# Altium schematic sheet Extruder.SchDoc: Extruder
size A4; DrawnBy: oaba200
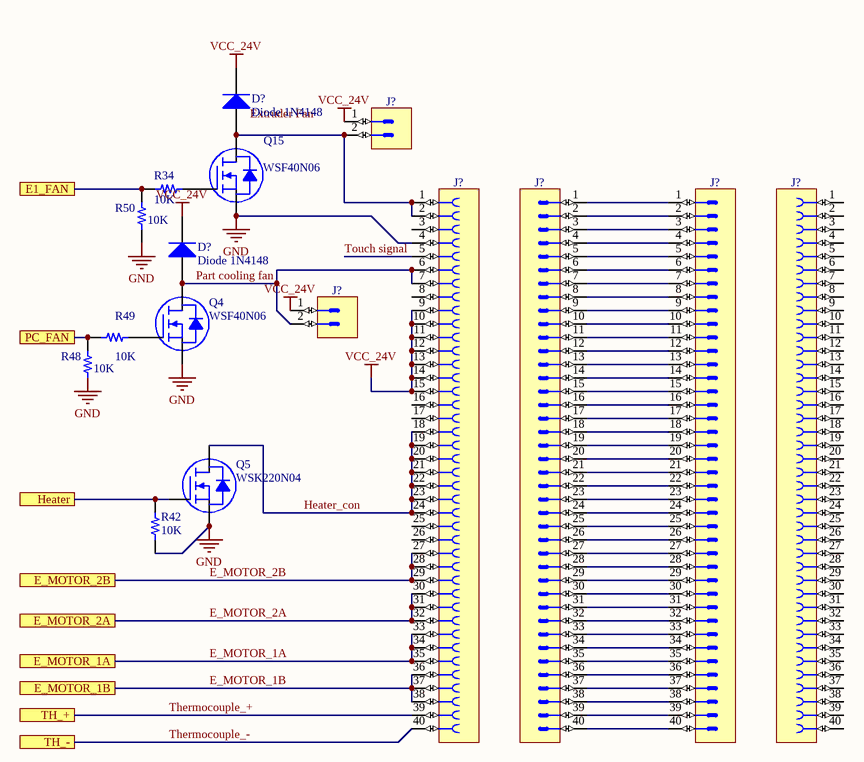
[diagram p0: Extruder.SchDoc]

## Parts
(Parts that share a designator on the sheet are numbered #1, #2 ... from top to bottom, then left to right.)
D?#1  Diode 1N4148  [DO-35]
D?#2  Diode 1N4148  [DO-35]
J?#1  (no value)
J?#2  (no value)
J?#3  (no value)
J?#4  (no value)
J?#5  (no value)
J?#6  (no value)
Q4  WSF40N06  [TO263]
Q5  WSK220N04  [TO263]
Q15  WSF40N06  [TO263]
R34  10K  [RES 0805_2012]
R42  10K  [RES 0805_2012]
R48  10K  [RES 0805_2012]
R49  10K  [RES 0805_2012]
R50  10K  [RES 0805_2012]

## Ports
E1_FAN, E_MOTOR_1A, E_MOTOR_1B, E_MOTOR_2A, E_MOTOR_2B, Heater, PC_FAN, TH_+, TH_-

## Nets
GND: J?#2.4 Q4.2(S) Q5.2(S) Q15.2(S) R42.1 R50.1
VCC_24V: D?#1.2(K) D?#2.2(K) J?#1.1 J?#2.9 J?#2.10 J?#2.11 J?#2.12 J?#2.13 J?#2.14 J?#2.15 J?#6.1
E1_FAN: R34.1 R50.2 ; port E1_FAN
E_MOTOR_1A: J?#2.33 J?#2.34 J?#2.35 ; port E_MOTOR_1A
E_MOTOR_1B: J?#2.36 J?#2.37 J?#2.38 ; port E_MOTOR_1B
E_MOTOR_2A: J?#2.30 J?#2.31 J?#2.32 ; port E_MOTOR_2A
E_MOTOR_2B: J?#2.27 J?#2.28 J?#2.29 ; port E_MOTOR_2B
Heater: Q5.1(G) R42.2 ; port Heater
Heater_con: J?#2.18 J?#2.19 J?#2.20 J?#2.21 J?#2.22 J?#2.23 J?#2.24 Q5.3(D)
Part cooling fan: D?#2.1(A) J?#2.6 J?#2.7 J?#6.2 Q4.3(D)
PC_FAN: R48.2 R49.1 ; port PC_FAN
Thermocouple_+: J?#2.39 ; port TH_+
Thermocouple_-: J?#2.40 ; port TH_-
Touch signal: J?#2.5
NetD?#1_1: D?#1.1(A) J?#1.2 J?#2.1 J?#2.2 Q15.3(D)
NetJ?#3_1: J?#3.1 J?#4.1
NetJ?#3_2: J?#3.2 J?#4.2
NetJ?#3_3: J?#3.3 J?#4.3
NetJ?#3_4: J?#3.4 J?#4.4
NetJ?#3_5: J?#3.5 J?#4.5
NetJ?#3_6: J?#3.6 J?#4.6
NetJ?#3_7: J?#3.7 J?#4.7
NetJ?#3_8: J?#3.8 J?#4.8
NetJ?#3_9: J?#3.9 J?#4.9
NetJ?#3_10: J?#3.10 J?#4.10
NetJ?#3_11: J?#3.11 J?#4.11
NetJ?#3_12: J?#3.12 J?#4.12
NetJ?#3_13: J?#3.13 J?#4.13
NetJ?#3_14: J?#3.14 J?#4.14
NetJ?#3_15: J?#3.15 J?#4.15
NetJ?#3_16: J?#3.16 J?#4.16
NetJ?#3_17: J?#3.17 J?#4.17
NetJ?#3_18: J?#3.18 J?#4.18
NetJ?#3_19: J?#3.19 J?#4.19
NetJ?#3_20: J?#3.20 J?#4.20
NetJ?#3_21: J?#3.21 J?#4.21
NetJ?#3_22: J?#3.22 J?#4.22
NetJ?#3_23: J?#3.23 J?#4.23
NetJ?#3_24: J?#3.24 J?#4.24
NetJ?#3_25: J?#3.25 J?#4.25
NetJ?#3_26: J?#3.26 J?#4.26
NetJ?#3_27: J?#3.27 J?#4.27
NetJ?#3_28: J?#3.28 J?#4.28
NetJ?#3_29: J?#3.29 J?#4.29
NetJ?#3_30: J?#3.30 J?#4.30
NetJ?#3_31: J?#3.31 J?#4.31
NetJ?#3_32: J?#3.32 J?#4.32
NetJ?#3_33: J?#3.33 J?#4.33
NetJ?#3_34: J?#3.34 J?#4.34
NetJ?#3_35: J?#3.35 J?#4.35
NetJ?#3_36: J?#3.36 J?#4.36
NetJ?#3_37: J?#3.37 J?#4.37
NetJ?#3_38: J?#3.38 J?#4.38
NetJ?#3_39: J?#3.39 J?#4.39
NetJ?#3_40: J?#3.40 J?#4.40
NetQ4_1: Q4.1(G) R49.2
NetQ15_1: Q15.1(G) R34.2

Not connected (* = marked no-connect by the designer): J?#2 3 8 16 17 25 26; J?#5 1 2 3 4 5 6 7 8 9 10 11 12 13 14 15 16 17 18 19 20 21 22 23 24 25 26 27 28 29 30 31 32 33 34 35 36 37 38 39 40; R48 1

## Notes on the sheet
- Labels drawn without touching a wire or pin: Extruder Fan, GND

## Library data of the parts
D?#1 D?#2 = Diode 1N4148: High Conductance Fast Diode; Published: 8-Jun-2000; LatestRevisionDate: 17-Jul-2002; LatestRevisionNote: Re-released for DXP Platform.; DatasheetVersion: 1997; PackageReference: DO-35; Publisher: Altium Limited; PackageDescription: Diode, Axial; Body 3.8 x 1.9 mm (LxDia. max), Lead Dia. 0.53 mm (max); Code_JEDEC: DO-204-AH; ComponentLink1Description: Manufacturer Link; ComponentLink1URL: http://www.fairchildsemi.com/; ComponentLink2Description: Datasheet; ComponentLink2URL: http://www.fairchildsemi.com/ds/1N%2F1N4148.pdf
J?#1 J?#6 = Connector 2 Male
J?#2 J?#5 = Connector 40 Female
J?#3 J?#4 = Connector 40 Male
Q4 Q5 Q15 = WSK220N04: N-Ch MOSFET / 40V  220A
R34 R42 R48-R50 = Resistor: SMT Resistor; VALUE: 10K